# EAGLE design 2chadc (EAGLE 6.6.0)
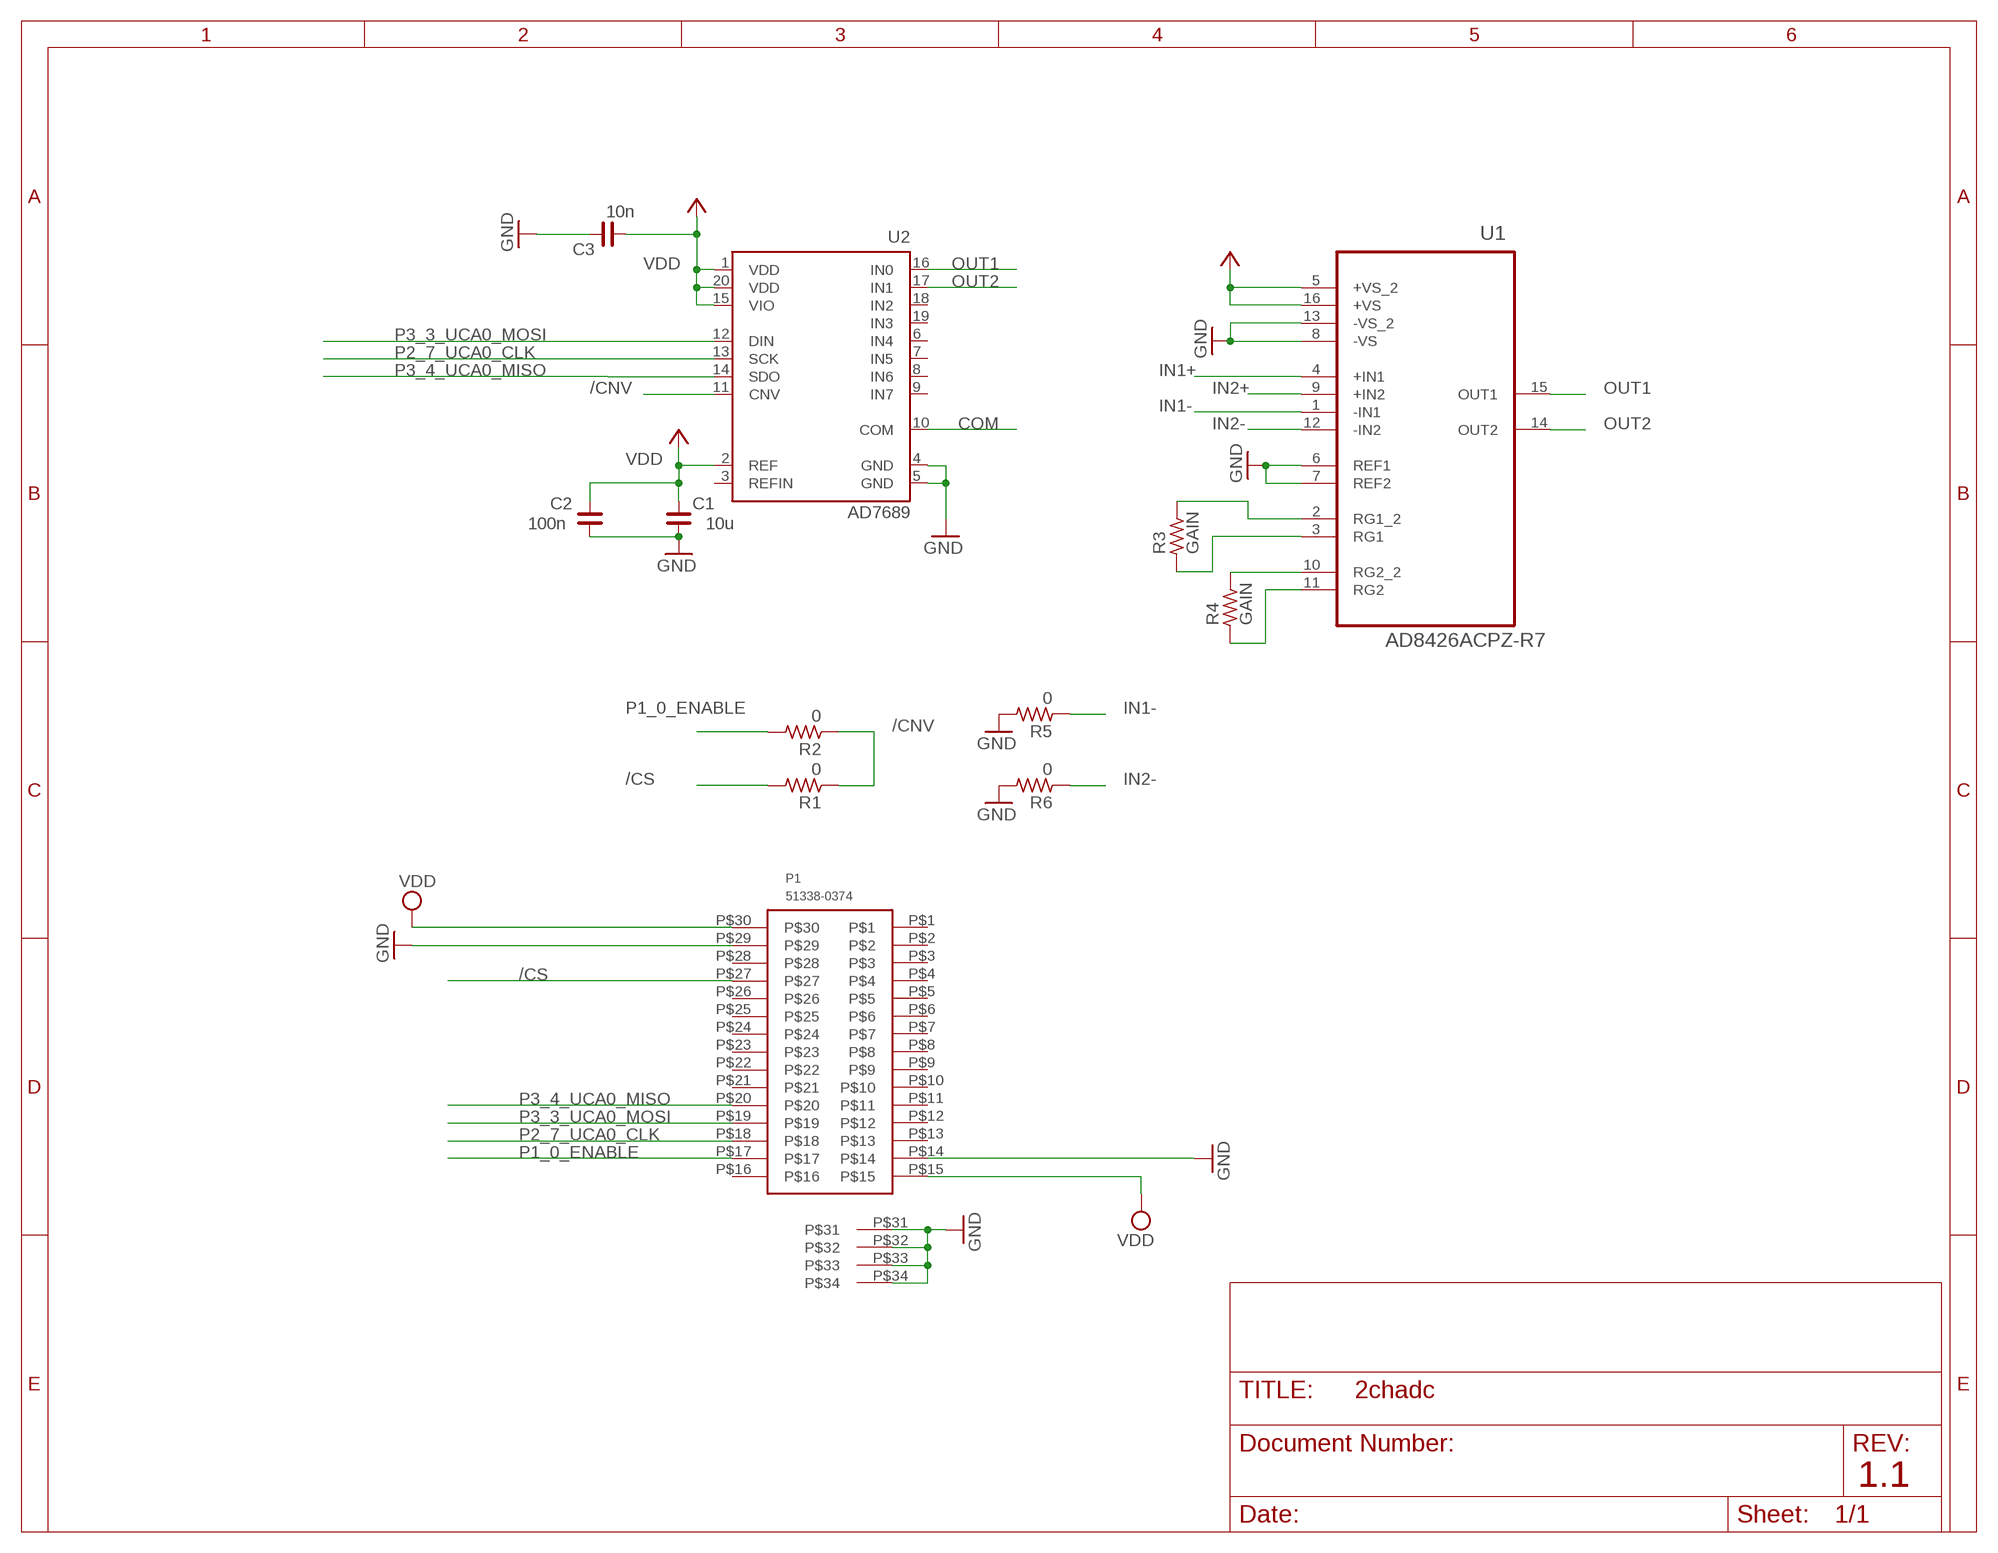
[diagram p0: schematic, sheet 1]

## Parts
C1  10u  C_0402  [C0402]
C2  100n  C_0402  [C0402]
C3  10n  C_0402  [C0402]
P1  51338-0374  51338-0374_RECEPTACLE  [51338-0374_RECEPTACLE]
R1  0  R_0402  [R0402]
R2  0  R_0402  [R0402]
R3  GAIN  R_0402  [R0402]
R4  GAIN  R_0402  [R0402]
R5  0  R_0402  [R0402]
R6  0  R_0402  [R0402]
U1  AD8426ACPZ-R7  [QFN65P400X400X100-16N]
U2  AD7689  [LFCSP20]

## Nets
+3V3: U1.5(+VS_2) U1.16(+VS)
/CNV: R1.1 R2.1 U2.11(CNV)
/CS: P1.P$27 R1.2
COM: U2.10(COM)
GND: C1.1 C2.1 C3.2 P1.P$14 P1.P$29 P1.P$31 P1.P$32 P1.P$33 P1.P$34 R5.2 R6.2 U1.6(REF1) U1.7(REF2) U1.8(-VS) U1.13(-VS_2) U2.4(GND) U2.5(GND)
IN1+: U1.4(+IN1)
IN1-: R5.1 U1.1(-IN1)
IN2+: U1.9(+IN2)
IN2-: R6.1 U1.12(-IN2)
N$4: R4.2 U1.10(RG2_2)
N$5: R4.1 U1.11(RG2)
N$6: R3.1 U1.3(RG1)
N$7: R3.2 U1.2(RG1_2)
OUT1: U1.15(OUT1) U2.16(IN0)
OUT2: U1.14(OUT2) U2.17(IN1)
P1_0_ENABLE: P1.P$17 R2.2
P2_7_UCA0_CLK: P1.P$18 U2.13(SCK)
P3_3_UCA0_MOSI: P1.P$19 U2.12(DIN)
P3_4_UCA0_MISO: P1.P$20 U2.14(SDO)
VDD: C1.2 C2.2 C3.1 P1.P$15 P1.P$30 U2.1(VDD) U2.2(REF) U2.15(VIO) U2.20(VDD) ; supply symbol labelled +3V3
Unconnected: P1.P$1 P1.P$2 P1.P$3 P1.P$4 P1.P$5 P1.P$6 P1.P$7 P1.P$8 P1.P$9 P1.P$10 P1.P$11 P1.P$12 P1.P$13 P1.P$16 P1.P$21 P1.P$22 P1.P$23 P1.P$24 P1.P$25 P1.P$26 P1.P$28 U2.3(REFIN) U2.6(IN4) U2.7(IN5) U2.8(IN6) U2.9(IN7) U2.18(IN2) U2.19(IN3)

## Notes on the sheet
- 1.1

## Library data of the parts
C1-C3 = rc-master-smd:C_: NON-POLARIZED CAP
P1 = Molex_SlimStack:51338-0374_RECEPTACLE
R1-R6 = rc-master-smd:R_: RESISTOR
U1 = analog-devices:AD8426ACPZ-R7: Wide Supply Range, Rail-to-Rail Output Instrumentation Amplifier; MPN: AD8426ACPZ-R7; OC_FARNELL: 1971714; OC_NEWARK: 58T4523; PACKAGE: LFCSP-16; SUPPLIER: Analog Devices
U2 = analog-devices:AD7689

## Board
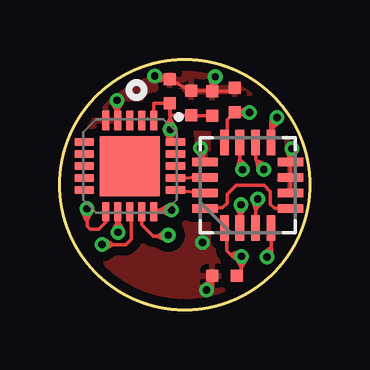
[diagram p1: board, top side]
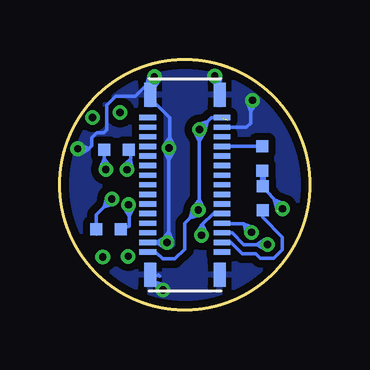
[diagram p2: board, bottom side, seen from below]

Size 10.4 x 10.4 mm. Coordinates in mm from the lower left corner, seen from the top.
Outline: circle at 5.2,5.2 radius 5.2
Copper layers (1*16): Top 0.035mm / dielectric 1.5mm / Bottom 0.035mm
Design rules "DIRTY_PCB *": minimum track width 5mil, minimum drill 12mil, track to track 5mil, track to pad 5mil, pad to pad 5mil, via to via 5mil, smd to smd 0mil, copper to edge 10mil, drill to drill 10mil, minimum pad ring 10mil, minimum via ring 6mil, stop-mask expansion 0mil, vias tented up to drill 25mil, thermal gap 10mil

### Footprints (pad centres in the part's own frame; a part is rotated, then mirrored left to right if it is on the bottom)
C0402 = smd 0.5 x 0.5: 1 -0.508,0; 2 0.508,0
51338-0374_RECEPTACLE = smd 0.7 x 0.22: P$1 -1.55,2.8; P$2 -1.55,2.4; P$3 -1.55,2; P$4 -1.55,1.6; P$5 -1.55,1.2; P$6 -1.55,0.8; P$7 -1.55,0.4; P$8 -1.55,0; P$9 -1.55,-0.4; P$10 -1.55,-0.8; P$11 -1.55,-1.2; P$12 -1.55,-1.6; P$13 -1.55,-2; P$14 -1.55,-2.4; P$15 -1.55,-2.8; P$16 1.55,-2.8; P$17 1.55,-2.4; P$18 1.55,-2; P$19 1.55,-1.6; P$20 1.55,-1.2; P$21 1.55,-0.8; P$22 1.55,-0.4; P$23 1.55,0; P$24 1.55,0.4; P$25 1.55,0.8; P$26 1.55,1.2; P$27 1.55,1.6; P$28 1.55,2; P$29 1.55,2.4; P$30 1.55,2.8 | smd 0.5 x 1: P$31 1.45,3.75; P$32 -1.45,3.75; P$33 -1.45,-3.75; P$34 1.45,-3.75
R0402 = smd 0.5 x 0.5: 1 -0.508,0; 2 0.508,0
QFN65P400X400X100-16N = smd 1.067 x 0.356: 1 -1.778,0.965; 2 -1.778,0.33; 3 -1.778,-0.33; 4 -1.778,-0.965; 9 1.778,-0.965; 10 1.778,-0.33; 11 1.778,0.33; 12 1.778,0.965 | smd 0.356 x 1.067: 5 -0.965,-1.778; 6 -0.33,-1.778; 7 0.33,-1.778; 8 0.965,-1.778; 13 0.965,1.778; 14 0.33,1.778; 15 -0.33,1.778; 16 -0.965,1.778
LFCSP20 = smd 0.8 x 0.3: 1 -1.9,1; 2 -1.9,0.5; 3 -1.9,0; 4 -1.9,-0.5; 5 -1.9,-1; 11 1.9,-1; 12 1.9,-0.5; 13 1.9,0; 14 1.9,0.5; 15 1.9,1 | smd 0.3 x 0.8: 6 -1,-1.9; 7 -0.5,-1.9; 8 0,-1.9; 9 0.5,-1.9; 10 1,-1.9; 16 1,1.9; 17 0.5,1.9; 18 0,1.9; 19 -0.5,1.9; 20 -1,1.9 | smd 2.5 x 2.5: 21 0,0

### Placement (x,y rotation side)
C1  5.47,8.61 270 top
C2  4.58,9.1 270 top
C3  6.34,8.59 90 top
P1  5.2,5.2 0 bottom
R1  1.98,6.29 90 bottom
R2  1.96,4.64 270 bottom
R3  8.38,3.35 0 bottom
R4  8.04,6.67 180 bottom
R5  6.85,1.41 180 top
R6  7.28,8.73 90 top
U1  7.82,5.18 90 top
U2  2.91,5.98 270 top

### Tracks (layer width: path | path; a pad name or v marks a point on that pad's centre or on a via)
+3V3
  Top 0.152: U1.5 8.96,4.21 8.77,4.4 8.77,4.92 8.5,5.19 7.35,5.19 6.96,4.8 6.96,4.44 6.77,4.25 6.09,4.25 U1.16
/CNV  (via drill 0.3)  (1 unrouted)
  Top 0.152: 1.13,3.74 1.13,3.48 1.27,3.34 1.61,3.34 1.91,3.64 U2.11 | 1.13,3.74 v1.13,4.2 | 1.08,3.75 0.93,4.09 1.32,4.09 1.12,3.75 | 1.13,3.74 1.33,4.09 v1.13,4.2 | 1.13,3.74 0.93,4.09 v1.13,4.2
  Bottom 0.152: R2.1 1.43,4.54 | 1.43,4.54 v1.13,4.2 | 0.92,4.24 1.34,4.24 1.47,4.57 1.43,4.55 | 1.43,4.55 0.97,4.32 | 0.97,4.32 0.89,4.16 0.97,4.4 1.42,4.54 1.37,4.15 | 0.97,4.32 1.09,4.2 v1.13,4.2 | 1.43,4.54 1.06,4.42 v1.13,4.2 | 1.43,4.54 1.35,4.16 v1.13,4.2 | v1.13,4.2 1.07,4.42 1.45,4.53 1.35,4.14 v1.13,4.2 | 1.43,4.55 1.05,4.42 v1.13,4.2 | 1.43,4.55 1.35,4.16 v1.13,4.2
  Bottom 0.254: R1.1 1.96,5.78 R2.1
/CS
  Bottom 0.152: R1.2 2.77,6.8 P1.P$27
GND  (via drill 0.3)
  Top 0.152: C3.2 6.34,9.12 C1.1 5.47,9.11 C2.1 4.39,9.61 | U1.6 U1.7 U1.8 9.6,6.25 | 9.6,6.25 9.61,6.65 v9.66,6.7 | U1.13 5.92,6.28 | 5.92,6.28 5.86,6.34 v5.86,6.73 | U2.4 2.38,7.91 2.38,8.26 | 2.38,8.26 v2.38,8.72 | 4.39,9.61 4.07,9.61 v3.95,9.73 | v6.47,9.7 6.34,9.57 6.34,9.26 | 6.34,9.26 C3.2 | R6.2 7.14,9.1 C3.2 | v6.11,0.82 6.34,1.05 6.34,1.21 | 6.34,1.21 R5.2 | 9.6,6.25 9.84,6.56 v9.66,6.7 | 9.6,6.25 9.45,6.61 v9.66,6.7 | 5.92,6.28 6.07,6.64 v5.86,6.73 | 5.92,6.28 5.68,6.59 v5.86,6.73 | 4.39,9.61 4.11,9.89 v3.95,9.73 | 4.39,9.61 4.01,9.51 v3.95,9.73 | 2.38,8.26 | 2.38,8.26 | 2.38,8.26 2.18,8.61 | 2.38,8.26 2.58,8.61 | 2.58,8.61 | v2.38,8.72 2.58,8.61 | 2.38,8.26 2.18,8.61 | v2.38,8.72 2.18,8.61 | 2.38,8.26 2.58,8.61 | v2.38,8.72 2.58,8.61 | 2.38,8.26 2.18,8.61 | v2.38,8.72 2.18,8.61 | 6.34,9.26 6.63,9.53 v6.47,9.7 | 6.34,9.26 6.25,9.65 v6.47,9.7 | 6.34,1.21 6,1.02 v6.11,0.82 | 6.34,1.21 6.34,0.82 v6.11,0.82
  Bottom 0.152: v2.38,8.72 2.34,8.76 2.34,8.78 2.46,8.66 2.46,8.27 | 2.46,8.27 2.46,7.77 2.63,7.6 P1.P$29 | 6.4,2.8 P1.P$14 | 6.4,2.8 v5.94,2.8 | P1.P$31 3.75,9.32 | 3.75,9.32 3.75,9.53 v3.95,9.73 | P1.P$32 6.47,9.13 6.47,9.24 | 6.47,9.24 v6.47,9.7 | v5.86,6.73 5.82,6.77 5.82,7.19 | 5.82,7.19 5.82,8 6.47,8.65 | 6.05,3 5.86,3.19 5.86,3.25 | 5.86,3.25 5.86,6.27 | 5.86,6.27 v5.86,6.73 | v6.47,9.7 6.79,9.38 | 6.79,9.38 7.27,8.9 8.07,8.9 8.46,8.51 8.46,7.49 8.58,7.37 8.87,7.37 9.08,7.16 9.08,6.83 9.2,6.71 | v9.66,6.7 9.21,6.7 9.2,6.71 | 6.61,1.41 R5.2 6.3,1.45 6.24,1.39 | P1.P$33 6.65,1.36 6.43,1.14 | 6.43,1.14 v6.11,0.82 | 9.2,6.71 9.54,6.5 v9.66,6.7 | 9.2,6.71 9.55,6.9 v9.66,6.7 | 5.82,7.19 5.65,6.83 v5.86,6.73 | 5.82,7.19 6.05,6.86 v5.86,6.73 | 5.86,6.27 6.06,6.62 v5.86,6.73 | 5.86,6.27 5.66,6.62 v5.86,6.73 | 6.4,2.8 | 6.4,2.8 6.05,3 | v5.94,2.8 6.05,3 | 6.4,2.8 | 6.4,2.8 6.05,2.6 | v5.94,2.8 6.05,2.6 | 6.4,2.8 6.05,3 | 6.05,3 | v5.94,2.8 6.05,3 | 6.4,2.8 6.05,2.6 | v5.94,2.8 6.05,2.6 | 6.4,2.8 6.05,3 | v5.94,2.8 6.05,3 | 6.4,2.8 6.05,2.6 | v5.94,2.8 6.05,2.6 | 5.86,3.25 5.73,2.88 v5.94,2.8 | 5.86,3.25 6.12,2.95 v5.94,2.8 | 3.75,9.32 4.08,9.54 v3.95,9.73 | 3.75,9.32 3.72,9.71 v3.95,9.73 | 2.46,8.27 2.6,8.64 v2.38,8.72 | 2.46,8.27 2.21,8.57 v2.38,8.72 | 6.47,9.24 | 6.47,9.24 | 6.47,9.24 6.27,9.59 | 6.47,9.24 6.67,9.59 | 6.67,9.59 | v6.47,9.7 6.67,9.59 | 6.47,9.24 6.27,9.59 | v6.47,9.7 6.27,9.59 | 6.47,9.24 6.67,9.59 | v6.47,9.7 6.67,9.59 | 6.47,9.24 6.27,9.59 | v6.47,9.7 6.27,9.59 | 6.79,9.38 6.69,9.76 v6.47,9.7 | 6.79,9.38 6.41,9.48 v6.47,9.7 | 6.43,1.14 6.05,1.04 v6.11,0.82 | 6.43,1.14 6.33,0.76 v6.11,0.82
  pour Top (isolate 0.381): 0.2,5.2 arc-90 5.2,10.2 arc-90 10.2,5.2 arc-90 5.2,0.2 arc-90
  pour Bottom (isolate 0.305): 0.2,5.2 arc-90 5.2,10.2 arc-90 10.2,5.2 arc-90 5.2,0.2 arc-90
IN1+  (via drill 0.3)
  Top 0.152: v8.62,2.19 8.79,2.37 8.79,2.61 | 8.79,2.61 U1.4 | 8.79,2.61 8.48,2.37 | v8.62,2.19 8.48,2.37 | 8.79,2.61 8.85,2.22 | 8.85,2.22 | v8.62,2.19 8.85,2.22 | 8.79,2.61 8.48,2.37 | v8.62,2.19 8.48,2.37 | 8.79,2.61 8.85,2.22 | v8.62,2.19 8.85,2.22
IN1-  (via drill 0.3)
  Top 0.152: U1.1 6.95,3.4 6.95,2.45 7.11,2.29 | 7.11,2.29 7.18,2.22 v7.56,2.22 | R5.1 7.56,1.61 7.56,1.76 | 7.56,1.76 v7.56,2.22 | 7.11,2.29 7.42,2.04 v7.56,2.22 | 7.11,2.29 7.48,2.43 v7.56,2.22 | 7.56,1.76 7.76,2.11 v7.56,2.22 | 7.56,1.76 7.36,2.11 v7.56,2.22
IN2+  (via drill 0.3)
  Top 0.152: U1.9 8.79,7.63 | 8.79,7.63 8.79,7.82 v9.04,8.01 | 8.84,7.6 8.8,7.52 8.88,7.58 | 8.84,7.6 8.98,7.93 v9.04,8.01 | 8.88,7.58 9.11,7.78 v9.04,8.01 | 8.79,7.63 9.14,7.81 v9.04,8.01 | 8.79,7.63 8.81,8.02 v9.04,8.01 | 8.84,7.6 9.17,7.82 v9.04,8.01 | 8.84,7.6 8.81,8 v9.04,8.01 | 8.88,7.58 9.18,7.83 v9.04,8.01 | 8.88,7.58 8.81,7.97 v9.04,8.01
IN2-  (via drill 0.3)
  Top 0.152: U1.12 6.97,7.06 6.97,7.91 R6.1 7.44,8.22 | 7.44,8.22 v7.9,8.21 | 7.44,8.22 7.78,8.01 v7.9,8.21 | 7.44,8.22 7.79,8.41 v7.9,8.21
N$4  (via drill 0.3)
  Top 0.152: U1.10 8.12,6.92 8.16,6.88 8.16,6.24 8.2,6.2 | 8.2,6.2 8.49,5.91 v8.49,5.84 | 8.2,6.2 8.26,5.8 v8.49,5.84 | 8.2,6.2 8.57,6.05 v8.49,5.84
  Bottom 0.152: R4.2 8.55,6.29 | 8.55,6.29 8.55,6.07 v8.49,5.84 | 8.55,6.29 8.31,5.98 v8.49,5.84 | 8.55,6.29 8.7,5.93 v8.49,5.84
N$5  (via drill 0.3)
  Top 0.152: v7.61,5.83 7.5,5.94 U1.11 | 7.5,6.27 7.77,5.99 | v7.61,5.83 7.77,5.99 | 7.5,6.27 7.39,5.89 v7.61,5.83 | 7.5,6.27 7.77,5.99 | v7.61,5.83 7.77,5.99
  Bottom 0.152: R4.1 7.45,6.59 7.45,6.29 7.47,6.27 | 7.47,6.27 7.61,6.13 v7.61,5.83 | 7.47,6.27 7.39,5.88 v7.61,5.83 | 7.47,6.27 7.77,6 v7.61,5.83
N$6  (via drill 0.3)
  Top 0.152: U1.3 8.16,4.16 | 8.16,4.16 8.16,4.53 v8.24,4.61 | 8.16,4.16 8.41,4.46 v8.24,4.61 | 8.16,4.16 8.03,4.53 v8.24,4.61
  Bottom 0.152: R3.1 8.89,3.15 8.89,3.96 8.56,4.29 | 8.56,4.29 v8.24,4.61 | 8.56,4.29 8.46,4.67 v8.24,4.61 | 8.56,4.29 8.18,4.39 v8.24,4.61
N$7  (via drill 0.3)
  Top 0.152: U1.2 7.54,3.44 7.52,3.44 7.52,3.91 | 7.52,3.91 7.52,4.37 v7.54,4.37 | 7.52,3.91 7.73,4.25 v7.54,4.37 | 7.52,3.91 7.34,4.26 v7.54,4.37
  Bottom 0.152: R3.2 7.54,3.48 7.52,3.48 7.52,3.91 | 7.52,3.91 7.52,4.37 v7.54,4.37 | 7.52,3.91 7.73,4.25 v7.54,4.37 | 7.52,3.91 7.34,4.26 v7.54,4.37
OUT1
  Top 0.152: U2.16 U1.15
OUT2
  Top 0.152: U2.17 U1.14
P1_0_ENABLE
  Bottom 0.152: R2.2 1.96,3.84 1.14,3.02 1.14,2.49 1.5,2.13 2.06,2.13 2.25,2.32 2.81,2.32 3.29,2.8 P1.P$17
P2_7_UCA0_CLK  (via drill 0.3)
  Top 0.152: 2.21,2.71 2.74,2.71 2.96,2.93 2.96,4.03 arc90 U2.13 | 2.21,2.71 v1.75,2.71 | 2.21,2.71 1.86,2.91 v1.75,2.71 | 2.21,2.71 1.86,2.51 v1.75,2.71
  Bottom 0.152: P1.P$18 3.23,3.2 2.74,2.71 2.21,2.71 | 2.21,2.71 v1.75,2.71 | 2.21,2.71 1.86,2.91 v1.75,2.71 | 2.21,2.71 1.86,2.51 v1.75,2.71
P3_3_UCA0_MOSI  (via drill 0.3)
  Top 0.152: v2.42,3.22 v2.41,3.23 2.41,3.68 | 2.41,3.68 U2.12 | 2.41,3.68 | 2.41,3.68 2.22,3.33 | 2.22,3.33 | v2.42,3.22 2.22,3.33 | 2.41,3.68 2.62,3.34 | 2.41,3.68 2.22,3.33 | v2.42,3.22 2.22,3.33 | 2.41,3.68 2.62,3.34 | v2.42,3.22 2.62,3.34
  Bottom 0.152: P1.P$19 3.62,3.57 2.74,3.57 2.73,3.56 | 2.73,3.56 2.42,3.25 v2.42,3.22 | 2.73,3.56 | 2.73,3.56 | 2.73,3.56 2.64,3.17 | 2.73,3.56 2.35,3.44 | 2.35,3.44 | v2.42,3.22 2.35,3.44 | 2.73,3.56 2.64,3.17 | v2.42,3.22 2.64,3.17 | 2.73,3.56 2.35,3.44 | v2.42,3.22 2.35,3.44 | 2.73,3.56 2.64,3.17 | v2.42,3.22 2.64,3.17
P3_4_UCA0_MISO  (via drill 0.3)
  Top 0.152: v4.51,3.1 4.47,3.06 4.05,3.06 | 4.05,3.06 3.88,3.06 3.41,3.53 U2.14 | 4.05,3.06 4.41,2.89 v4.51,3.1 | 4.05,3.06 4.38,3.29 v4.51,3.1
  Bottom 0.152: P1.P$20 4.02,4 4.46,3.56 | 4.46,3.56 4.51,3.51 v4.51,3.1 | 4.46,3.56 4.3,3.19 v4.51,3.1 | 4.46,3.56 4.7,3.23 v4.51,3.1
VDD  (via drill 0.3)  (1 unrouted)
  Top 0.152: C2.2 4.59,8.1 C1.2 5.47,8.08 C3.1 | v4.59,7.5 C2.2 | U2.15 3.98,4.15 4.18,4.15 | 4.18,4.15 v4.64,4.15 | U2.20 4.59,6.98 4.59,7.04 | 4.59,7.04 v4.59,7.5 | U2.1 3.91,8.59 C2.2 | 4.18,4.15 | 4.18,4.15 4.53,3.95 | v4.64,4.15 4.53,3.95 | 4.18,4.15 | 4.18,4.15 4.53,4.35 | v4.64,4.15 4.53,4.35 | 4.18,4.15 4.53,3.95 | 4.53,3.95 | v4.64,4.15 4.53,3.95 | 4.18,4.15 4.53,4.35 | v4.64,4.15 4.53,4.35 | 4.18,4.15 4.53,3.95 | v4.64,4.15 4.53,3.95 | 4.18,4.15 4.53,4.35 | v4.64,4.15 4.53,4.35 | 4.59,7.96 4.79,7.62 | v4.59,7.5 4.79,7.62 | 4.59,7.04 | 4.59,7.04 | 4.59,7.04 4.39,7.39 | 4.59,7.96 4.39,7.61 v4.59,7.5 | 4.59,7.96 4.79,7.62 | v4.59,7.5 4.79,7.62 | 4.59,7.04 4.79,7.39 | 4.79,7.39 | v4.59,7.5 4.79,7.39 | 4.59,7.04 4.39,7.39 | v4.59,7.5 4.39,7.39 | 4.59,7.04 4.79,7.39 | v4.59,7.5 4.79,7.39 | 4.59,7.04 4.39,7.39 | v4.59,7.5 4.39,7.39
  Bottom 0.152: v4.64,4.15 4.96,3.83 | 4.96,3.83 5.2,3.59 5.2,2.52 5.61,2.11 6.12,2.11 6.41,2.4 P1.P$15 | v4.59,7.5 4.27,7.82 | 4.27,7.82 4.09,8 P1.P$30 | v4.64,4.15 4.59,4.2 4.59,4.6 | 4.59,4.6 4.59,7.04 | 4.59,7.04 v4.59,7.5 | 4.96,3.83 4.86,4.21 v4.64,4.15 | 4.96,3.83 4.58,3.93 v4.64,4.15 | 4.59,4.6 4.43,4.24 v4.64,4.15 | 4.59,4.6 4.82,4.29 v4.64,4.15 | 4.59,7.04 | 4.59,7.04 | 4.59,7.04 4.39,7.39 | 4.27,7.82 4.37,7.44 v4.59,7.5 | 4.27,7.82 4.65,7.72 v4.59,7.5 | 4.59,7.04 4.79,7.39 | 4.79,7.39 | v4.59,7.5 4.79,7.39 | 4.59,7.04 4.39,7.39 | v4.59,7.5 4.39,7.39 | 4.59,7.04 4.79,7.39 | v4.59,7.5 4.79,7.39 | 4.59,7.04 4.39,7.39 | v4.59,7.5 4.39,7.39